# EAGLE design lipol2 (EAGLE 5.08)
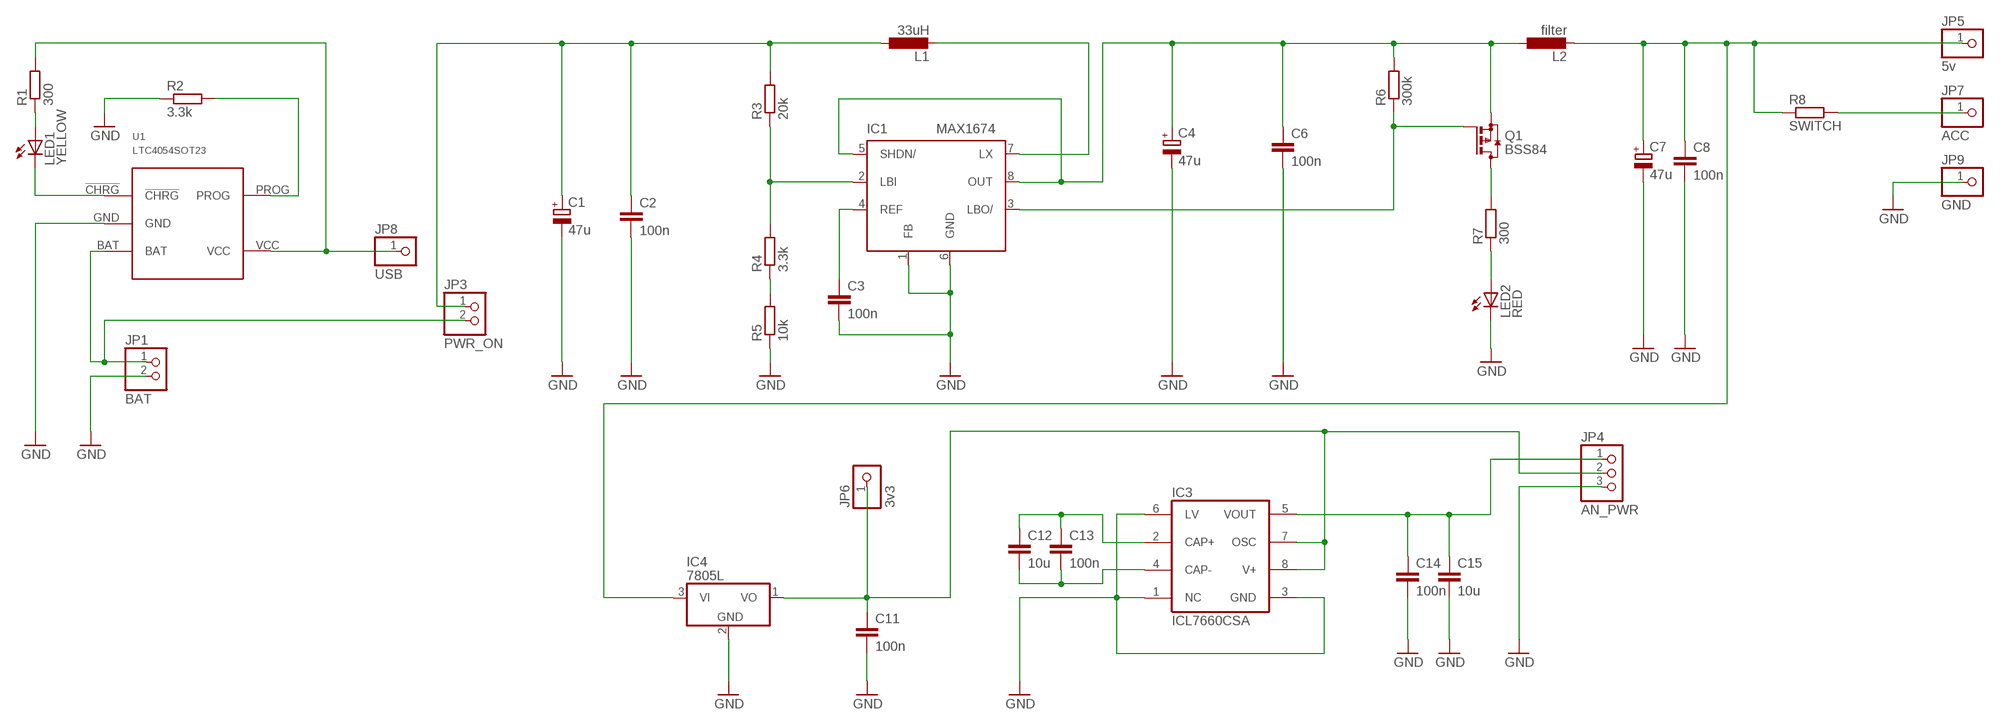
[diagram p0: schematic, sheet 1]

## Parts
C1  47u  CPOL-EUE2.5-5  [E2,5-5]
C2  100n  C-EUC1206K  [C1206K]
C3  100n  C-EUC1206  [C1206]
C4  47u  CPOL-EUE2.5-5  [E2,5-5]
C6  100n  C-EUC1206  [C1206]
C7  47u  CPOL-EUE2.5-5  [E2,5-5]
C8  100n  C-EUC1206K  [C1206K]
C11  100n  C-EUC1206K  [C1206K]
C12  10u  C-EUC1206K  [C1206K]
C13  100n  C-EUC1206K  [C1206K]
C14  100n  C-EUC1206K  [C1206K]
C15  10u  C-EUC1206K  [C1206K]
IC1  MAX1674  [UMAX8]
IC3  ICL7660CSA  [SO08]
IC4  7805L  [TO92]
JP1  BAT  PINHD-1X2  [1X02]
JP3  PWR_ON  PINHD-1X2  [1X02]
JP4  AN_PWR  PINHD-1X3  [1X03]
JP5  5v  PINHD-1X1  [1X01]
JP6  3v3  PINHD-1X1  [1X01]
JP7  ACC  PINHD-1X1  [1X01]
JP8  USB  PINHD-1X1  [1X01]
JP9  GND  PINHD-1X1  [1X01]
L1  33uH  L-EUL4532P  [L4532P]
L2  filter  L-EU0204/5  [0204/5]
LED1  YELLOW  LED3MM  [LED3MM]
LED2  RED  LED3MM  [LED3MM]
Q1  BSS84  [SOT23]
R1  300  R-EU_R1206  [R1206]
R2  3.3k  R-EU_R1206  [R1206]
R3  20k  R-EU_R1206  [R1206]
R4  3.3k  R-EU_R1206  [R1206]
R5  10k  R-EU_R0805  [R0805]
R6  300k  R-EU_R1206  [R1206]
R7  300  R-EU_R1206  [R1206]
R8  SWITCH  R-EU_M1206  [M1206]
U1  LTC4054SOT23  [SOT23-5]

## Nets
GND: C1.- C2.2 C3.2 C4.- C6.2 C7.- C8.2 C11.2 C14.2 C15.2 IC1.1(FB) IC1.6(GND) IC3.1(NC) IC3.3(GND) IC3.6(LV) IC4.2(GND) JP1.2 JP4.3 JP9.1 LED2.K(C) R2.1 R5.1 U1.GND
N$1: R2.2 U1.PROG
N$2: Q1.3(D) R7.2
N$3: LED1.A R1.1
N$4: LED1.K(C) U1.!CHRG
N$5: JP1.1 JP3.2 U1.BAT
N$6: IC1.3(LBO/) Q1.1(G) R6.1
N$7: C1.+ C2.1 JP3.1 L1.1 R3.2
N$8: IC1.2(LBI) R3.1 R4.2
N$9: R4.1 R5.2
N$10: IC1.7(LX) L1.2
N$11: C3.1 IC1.4(REF)
N$12: LED2.A R7.1
N$17: C11.1 IC3.7(OSC) IC3.8(V+) IC4.1(VO) JP4.2 JP6.1
N$18: C4.+ C6.1 IC1.5(SHDN/) IC1.8(OUT) L2.1 Q1.2(S) R6.2
N$19: C7.+ C8.1 IC4.3(VI) JP5.1 L2.2 R8.1
N$22: JP8.1 R1.2 U1.VCC
N$23: C12.1 C13.1 IC3.2(CAP+)
N$24: C12.2 C13.2 IC3.4(CAP-)
N$26: C14.1 C15.1 IC3.5(VOUT) JP4.1
N$28: JP7.1 R8.2

## Library data of the parts
C1 C4 C7 = rcl:CPOL-EU: POLARIZED CAPACITOR, European symbol
C2 C3 C6 C8 C11-C15 = rcl:C-EU: CAPACITOR, European symbol
IC1 = maxim:MAX1674: DC/DC CONVERTER
IC3 = maxim:ICL7660CSA: VOLTAGE CONVERTER
IC4 = linear:78*: Positive VOLTAGE REGULATOR Source: http://cache.national.com/ds/LM/LM78L05.pdf http://www.fairchildsemi.com/ds/LM/LM7805.pdf
JP1 JP3 = pinhead:PINHD-1X2: PIN HEADER
JP4 = pinhead:PINHD-1X3: PIN HEADER
JP5-JP9 = pinhead:PINHD-1X1: PIN HEADER
L1 = resistor:L-EU: INDUCTOR, European symbol
L2 = rcl:L-EU: INDUCTOR, European symbol
LED1 LED2 = led:LED: LED OSRAM: - CHIPLED LG R971, LG N971, LY N971, LG Q971, LY Q971, LO R971, LY R971 LH N974, LH R974 LS Q976, LO Q976, LY Q976 LO Q996 - Hyper CHIPLED LW Q18S LB Q993, LB Q99A, LB R99A - SideLED LS A670, LO A670, LY A670, LG A670, LP A670 LB A673, LV A673, LT A673, LW A673 LH A674 LY A675 LS A676, LA A676, LO A676, LY A676, LW A676 LS A679, LY A679, LG A679 - Hyper Micro SIDELED® LS Y876, LA Y876, LO Y876, LY Y876 LT Y87S - SmartLED LW L88C, LW L88S LB L89C, LB L89S, LG L890 LS L89K, LO L89K, LY L89K LS L896, LA L896, LO L896, LY L896 - TOPLED LS T670, LO T670, LY T670, LG T670, LP T670 LSG T670, LSP T670, LSY T670, LOP T670, LYG T670 LG T671, LOG T671, LSG T671 LB T673, LV T673, LT T673, LW T673 LH T674 LS T676, LA T676, LO T676, LY T676, LB T676, LH T676, LSB T676, LW T676 LB T67C, LV T67C, LT T67C, LS T67K, LO T67K, LY T67K, LW E67C LS E67B, LA E67B, LO E67B, LY E67B, LB E67C, LV E67C, LT E67C LW T67C LS T679, LY T679, LG T679 LS T770, LO T770, LY T770, LG T770, LP T770 LB T773, LV T773, LT T773, LW T773 LH T774 LS E675, LA E675, LY E675, LS T675 LS T776, LA T776, LO T776, LY T776, LB T776 LHGB T686 LT T68C, LB T68C - Hyper Mini TOPLED® LB M676 - Mini TOPLED Santana® LG M470 LS M47K, LO M47K, LY M47K Source: http://www.osram.convergy.de LUXEON: - LUMILED® LXK2-PW12-R00, LXK2-PW12-S00, LXK2-PW14-U00, LXK2-PW14-V00 LXK2-PM12-R00, LXK2-PM12-S00, LXK2-PM14-U00 LXK2-PE12-Q00, LXK2-PE12-R00, LXK2-PE12-S00, LXK2-PE14-T00, LXK2-PE14-U00 LXK2-PB12-K00, LXK2-PB12-L00, LXK2-PB12-M00, LXK2-PB14-N00, LXK2-PB14-P00, LXK2-PB14-Q00 LXK2-PR12-L00, LXK2-PR12-M00, LXK2-PR14-Q00, LXK2-PR14-R00 LXK2-PD12-Q00, LXK2-PD12-R00, LXK2-PD12-S00 LXK2-PH12-R00, LXK2-PH12-S00 LXK2-PL12-P00, LXK2-PL12-Q00, LXK2-PL12-R00 Source: www.luxeon.com KINGBRIGHT: KA-3528ASYC Source: www.kingbright.com
Q1 = transistor-small-signal:BSS84: P-CHANNEL MOS FET
R1-R8 = rcl:R-EU_: RESISTOR, European symbol
U1 = stabil:LTC4054

## Board
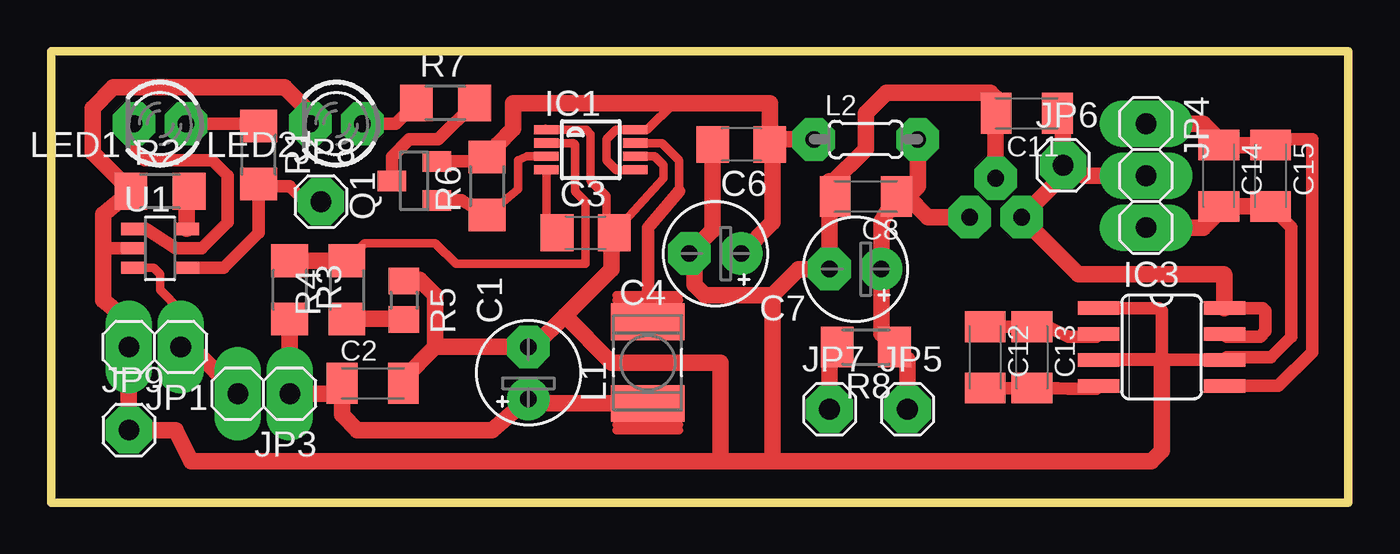
[diagram p1: board, top side]
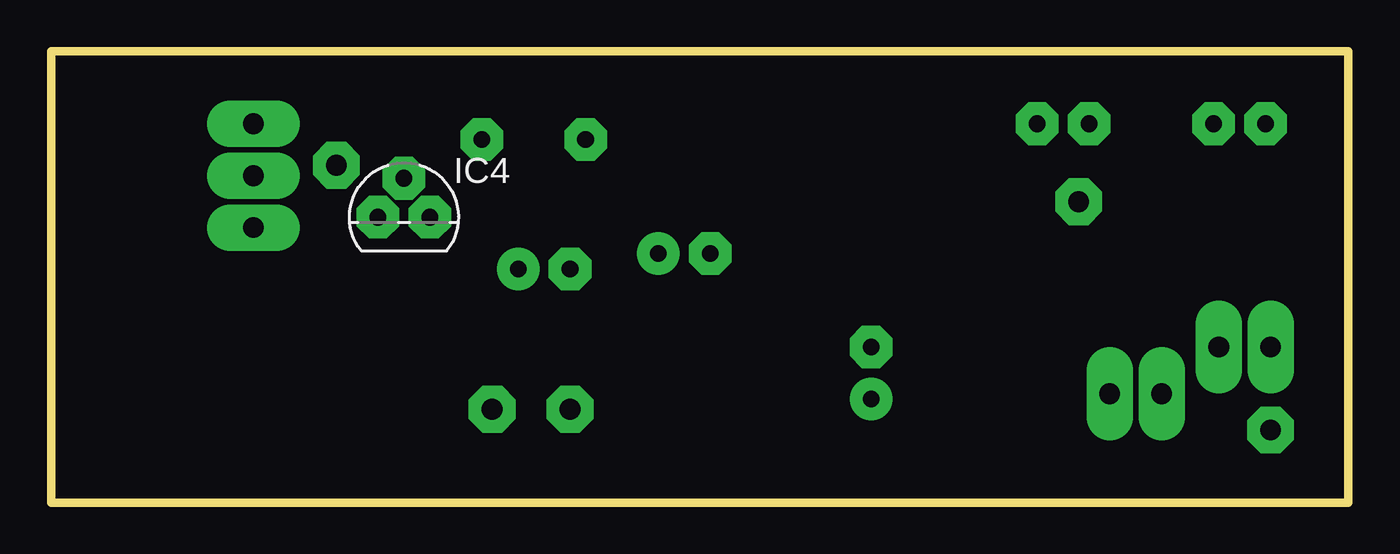
[diagram p2: board, bottom side, seen from below]

Size 63.5 x 22.1 mm. Coordinates in mm from the lower left corner, seen from the top.
Outline: 0,0 63.5,0 63.5,22.1 0,22.1 0,0
Copper layers (1*16): Top 0.035mm / dielectric 1.5mm / Bottom 0.035mm
Design rules "default *": minimum track width 16mil, minimum drill 32mil, track to track 8mil, track to pad 8mil, pad to pad 8mil, via to via 8mil, smd to smd 8mil, copper to edge 40mil, drill to drill 40mil, minimum pad ring 25mil, minimum via ring 12mil, stop-mask expansion 4mil, vias tented up to drill 0mil, thermal gap 10mil

### Footprints (pad centres in the part's own frame; a part is rotated, then mirrored left to right if it is on the bottom)
E2,5-5 = drill 0.813 pad 1.6 round: + -1.27,0 | drill 0.813 pad 1.6 octagon: - 1.27,0
C1206K = smd 1.5 x 2: 1 -1.5,0; 2 1.5,0
C1206 = smd 1.6 x 1.8: 1 -1.4,0; 2 1.4,0
UMAX8 = smd 0.45 x 1.2: 1 -0.975,-2.175; 2 -0.325,-2.175; 3 0.325,-2.175; 4 0.975,-2.175; 5 0.975,2.175; 6 0.325,2.175; 7 -0.325,2.175; 8 -0.975,2.175
SO08 = smd 0.66 x 2.032: 1 -1.905,-3.073; 2 -0.635,-3.073; 3 0.635,-3.073; 4 1.905,-3.073; 5 1.905,3.073; 6 0.635,3.073; 7 -0.635,3.073; 8 -1.905,3.073
TO92 = drill 0.813 octagon: 1 -1.27,0; 2 0,1.905; 3 1.27,0
1X02 = drill 1.016 long: 1 -1.27,0; 2 1.27,0
1X03 = drill 1.016 long: 1 -2.54,0; 2 0,0; 3 2.54,0
1X01 = drill 1.016 octagon: 1 0,0
L4532P = smd 1.8 x 3.6: 1 -2,0; 2 2,0
0204/5 = drill 0.813 octagon: 1 -2.54,0; 2 2.54,0
LED3MM = drill 0.813 octagon: A -1.27,0; K 1.27,0
SOT23 = smd 1 x 1.4: 1 -0.95,-1.1; 2 0.95,-1.1; 3 0,1.1
R1206 = smd 1.6 x 1.803: 1 -1.422,0; 2 1.422,0
R0805 = smd 1.3 x 1.5: 1 -0.95,0; 2 0.95,0
M1206 = smd 1.6 x 2: 1 -1.4,0; 2 1.4,0
SOT23-5 = smd 0.6 x 1.2: !CHRG -0.95,-1.306; BAT 0.95,-1.306; GND 0,-1.306; PROG -0.95,1.306; VCC 0.95,1.306

### Placement (x,y rotation side)
C1  23.37,6.35 90 top
C2  15.75,5.84 0 top
C3  26.16,13.21 0 top
C4  32.51,12.19 180 top
C6  33.78,17.53 180 top
C7  39.37,11.43 180 top
C8  39.88,14.99 180 top
C11  47.75,19.05 180 top
C12  45.72,7.11 270 top
C13  48.01,7.11 270 top
C14  57.15,16 270 top
C15  59.69,16 270 top
IC1  26.42,17.27 270 top
IC3  54.36,7.62 270 top
IC4  46.23,13.97 0 bottom
JP1  5.08,7.62 180 top
JP3  10.41,5.33 180 top
JP4  53.59,16 270 top
JP5  41.91,4.57 0 top
JP6  49.53,16.51 0 top
JP7  38.1,4.57 0 top
JP8  13.21,14.73 0 top
JP9  3.81,3.56 0 top
L1  29.21,6.86 90 top
L2  39.88,17.78 0 top
LED1  5.33,18.54 180 top
LED2  13.97,18.54 180 top
Q1  17.78,15.75 90 top
R1  10.16,17.02 270 top
R2  5.33,15.24 0 top
R3  11.68,10.41 270 top
R4  14.48,10.41 90 top
R5  17.27,9.91 270 top
R6  21.34,15.49 90 top
R7  19.3,19.56 0 top
R8  39.88,7.62 180 top
U1  5.33,12.45 270 top

### Tracks (layer width: path | path; a pad name or v marks a point on that pad's centre or on a via)
GND
  Top 0.406: 17.25,6.07 C2.2 | 18.03,10.92 17.34,10.92 R5.1 | IC1.6 29.54,16.95 29.97,16.51 29.97,15.87 C3.2 | 38.1,15.72 38.16,15.58 C8.2 | IC3.6 57.56,7.11 | 31.5,11.94 C4.- | 23.62,7.62 C1.- | 27.43,13.08 C3.2 | JP9.1 4.03,3.77 | 54.36,9.4 54.23,9.53 | 54.36,7.37 54.1,7.11 51.41,7.11 IC3.3 53.98,6.98 54.36,6.6 | C14.2 57.15,14.22 | 24.2,18.29 IC1.1 26.2,18.25 26.42,18.03 26.42,15.75 27.18,14.99 27.18,13.59 C3.2
  Top 0.61: 57.56,7.11 59.69,7.11 60.71,8.13 60.71,13.49 C15.2 | 54.23,9.53 IC3.1 | 54.36,7.37 54.36,9.4 | IC3.3 IC3.6 | 2.54,12.45 U1.GND
  Top 0.813: 18.8,7.62 17.25,6.07 | 18.8,7.62 18.8,10.16 18.03,10.92 | C1.- 18.8,7.62 | C15.2 C14.2 | 38.1,15.72 C7.- 36.58,11.43 35.31,10.16 | 35.31,10.16 32,10.16 31.5,10.67 31.5,11.94 | 25.15,9.14 23.62,7.62 | 25.15,9.14 27.43,11.43 27.43,13.08 | 35.31,2.03 35.31,10.16 | 33.02,2.03 6.86,2.03 6.1,3.56 JP9.1 JP1.2 3.81,8.89 2.54,9.91 2.54,12.45 2.54,14.12 R2.1 2.03,17.12 2.03,19.3 3.05,20.32 11.43,20.32 12.7,19.05 LED2.K | 33.02,2.03 35.31,2.03 | 54.36,6.6 54.36,2.54 53.85,2.03 35.31,2.03 | 25.15,9.14 27.43,6.86 32.77,6.86 32.77,2.29 33.02,2.03 | 57.15,14.22 56.39,13.46 JP4.3 | C6.2 32.38,13.33 C4.- | C11.2 46.23,19.03 IC4.2 46.23,19.81 45.97,20.07 40.89,20.07 39.88,19.05 39.88,17.3 38.16,15.58
N$1
  Top 0.406: 6.64,15.12 R2.2
  Top 0.813: U1.PROG 6.64,15.12
N$2
  Top 0.61: Q1.3 16.68,16.93 17.53,17.78 18.95,17.78 R7.2
N$3
  Top 0.406: 10.01,18.54 R1.1
  Top 0.61: LED1.A 10.01,18.54
N$4
  Top 0.406: U1.!CHRG 4.64,13.4
  Top 0.61: 4.64,13.4 6.1,12.45 7.37,12.45 8.64,13.72 8.64,16 7.87,16.76 4.57,16.76 4.06,17.27 LED1.K
N$5
  Top 0.406: U1.BAT 5.01,11.5 5.33,11.18 5.33,10.41 6.35,9.4 JP1.1
  Top 0.813: JP1.1 6.86,7.62 JP3.2
N$6
  Top 0.406: IC1.3 23.3,16.95 22.86,16.76 22.86,15.34 R6.1
  Top 0.61: Q1.1 20.1,14.8 R6.1
N$7
  Top 0.406: C1.+ 23.59,4.86 | 13.74,5.33 C2.1
  Top 0.813: R3.2 JP3.1 13.74,5.33 | C2.1 14.25,4.29 14.99,3.56 21.59,3.56 C1.+ | 23.59,4.86 L1.1
N$8
  Top 0.406: R4.2 15.34,12.7 18.8,12.7 19.81,11.68 26.16,11.68 26.16,14.73 25.65,15.24 25.65,17.53 25.58,17.6 IC1.2
  Top 0.813: R3.1 R4.2
N$9
  Top 0.406: 17.24,8.99 R5.2
  Top 0.813: R4.1 17.24,8.99
N$10
  Top 0.406: IC1.7 29.9,17.6 30.73,16.76 30.73,15.24
  Top 0.61: 30.73,15.24 29.21,13.46 L1.2
N$11
  Top 0.406: IC1.4 24.24,13.47 C3.1
N$12
  Top 0.61: LED2.A 16.87,18.54 R7.1
N$13
  Top 0.406: 27.69,3.81 30.73,3.81
N$14
  Top 0.406: 27.69,3.56 30.73,3.56
N$15
  Top 0.406: 27.69,9.91 30.73,9.91
N$16
  Top 0.406: 27.69,10.16 30.73,10.16
N$17
  Top 0.406: 57.56,8.13 IC3.7
  Top 0.61: IC3.8 59.31,9.53 59.44,9.4 59.44,8.38 59.18,8.13 57.56,8.13
  Top 0.813: JP6.1 49.53,18.77 C11.1 | JP6.1 49.53,16 IC4.1 50.29,11.18 57.4,11.18 57.43,11.15 IC3.8 | JP6.1 50.04,16.51 50.55,16 JP4.2
N$18
  Top 0.406: IC1.5 28.55,16.26 27.69,16.26 27.18,16.76 27.18,17.78 27.64,18.25 IC1.8 29.17,18.25 30.48,19.56 | 35.18,17.78 C6.1 | 21.63,16.7 R6.2 21.84,17.02
  Top 0.61: Q1.2 21.63,16.7 | 21.84,17.02 21.84,17.53
  Top 0.813: L2.1 35.18,17.78 35.18,19.56 30.48,19.56 22.61,19.56 22.61,18.29 21.84,17.53 | C4.+ 35.31,13.72 35.31,17.4 C6.1
N$19
  Top 0.406: C8.1 41.91,14.99
  Top 0.813: C8.1 40.64,13.74 C7.+ 40.64,8.26 R8.1 41.91,6.99 JP5.1 | L2.2 42.42,15.49 41.91,14.99 42.93,13.97 IC4.3
N$22
  Top 0.61: U1.VCC 8.45,11.5 10.16,13.21 R1.2 10.26,15.49 11.68,15.49 12.45,14.73 JP8.1
N$23
  Top 0.406: C13.1 48.79,8.61 | 51.16,8.13 IC3.2
  Top 0.61: C12.1 C13.1 | 48.79,8.61 49.78,8.13 51.16,8.13
N$24
  Top 0.406: 51.16,5.59 IC3.4
  Top 0.61: C12.2 C13.2 49.25,5.61 49.78,5.59 51.16,5.59
N$26
  Top 0.406: 59.97,17.78 C15.1 | C14.1 57.15,17.78
  Top 0.61: IC3.5 60.07,5.71 61.72,7.37 61.72,17.78 59.97,17.78
  Top 0.813: C15.1 C14.1 | 57.15,17.78 56.39,18.54 JP4.1
N$28
  Top 0.813: JP7.1 38.1,7.24 R8.2